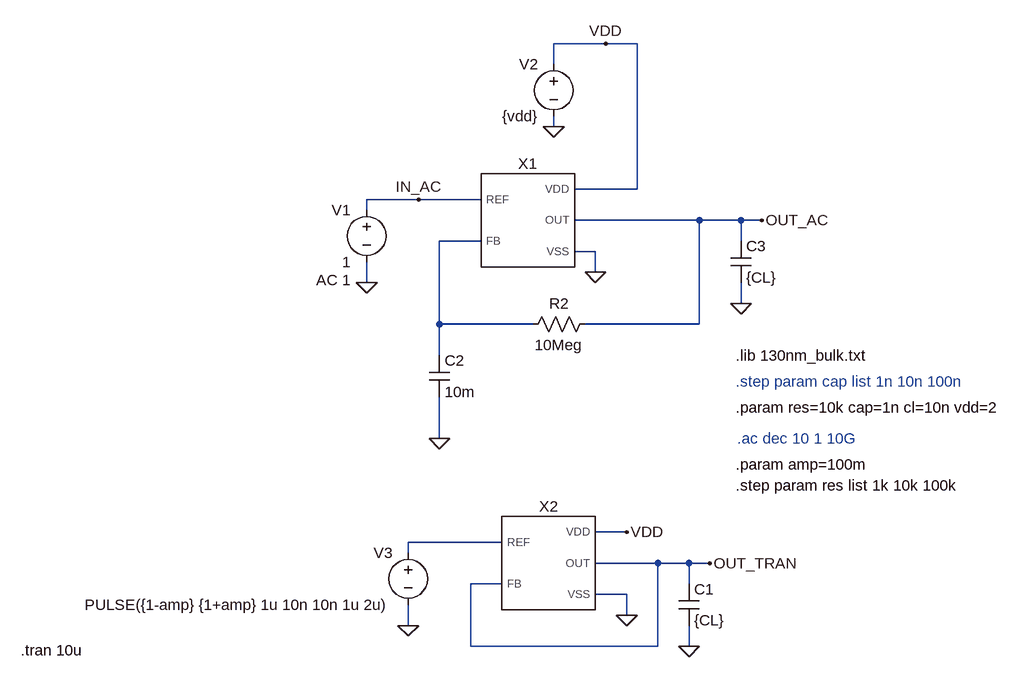
[diagram p0: schematic almost_ideal_curr_src.asc]
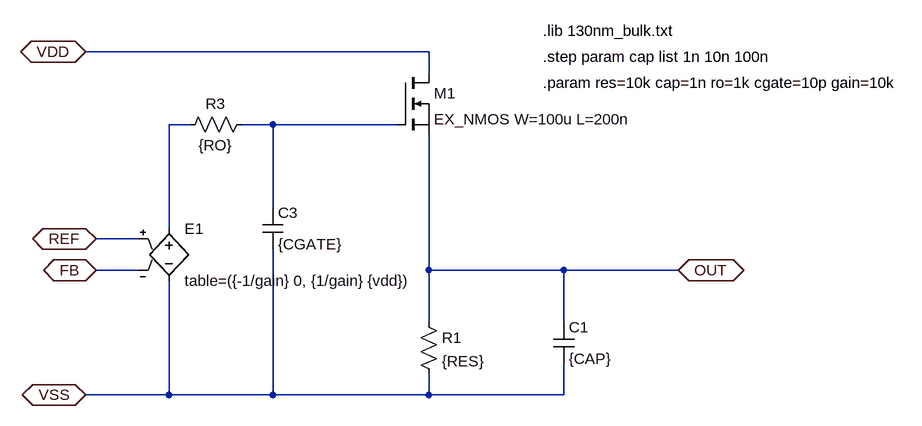
[diagram p1: sub-circuit fake_reference.asc]
almost_ideal_curr_src.asc, the LTspice schematic file:
Version 4
SHEET 1 1424 680
WIRE 96 -560 16 -560
WIRE 144 -560 96 -560
WIRE 16 -528 16 -560
WIRE 16 -432 16 -448
WIRE 144 -336 144 -560
WIRE 144 -336 48 -336
WIRE -192 -320 -272 -320
WIRE -96 -320 -192 -320
WIRE -272 -304 -272 -320
WIRE 240 -288 48 -288
WIRE 304 -288 240 -288
WIRE 336 -288 304 -288
WIRE -96 -256 -160 -256
WIRE 304 -256 304 -288
WIRE 80 -240 48 -240
WIRE 80 -208 80 -240
WIRE -272 -192 -272 -224
WIRE 304 -160 304 -192
WIRE -160 -128 -160 -256
WIRE -16 -128 -160 -128
WIRE 240 -128 240 -288
WIRE 240 -128 64 -128
WIRE -160 -80 -160 -128
WIRE -160 48 -160 -16
WIRE 128 192 80 192
WIRE -64 208 -208 208
WIRE -208 224 -208 208
WIRE 176 240 80 240
WIRE 224 240 176 240
WIRE 256 240 224 240
WIRE -64 272 -112 272
WIRE 224 272 224 240
WIRE 128 288 80 288
WIRE 128 320 128 288
WIRE -208 336 -208 304
WIRE -112 368 -112 272
WIRE 176 368 176 240
WIRE 176 368 -112 368
WIRE 224 368 224 336
FLAG -272 -192 0
FLAG 16 -432 0
FLAG 256 240 OUT_TRAN
FLAG -192 -320 IN_AC
FLAG -160 48 0
FLAG 80 -208 0
FLAG 336 -288 OUT_AC
FLAG 96 -560 VDD
FLAG 128 320 0
FLAG 128 192 VDD
FLAG -208 336 0
FLAG 224 368 0
FLAG 304 -160 0
SYMBOL voltage -272 -320 M0
WINDOW 123 24 124 Left 2
WINDOW 39 0 0 Left 0
SYMATTR InstName V1
SYMATTR Value 1
SYMATTR Value2 AC 1
SYMBOL voltage 16 -544 M0
WINDOW 123 0 0 Left 0
WINDOW 39 0 0 Left 0
SYMATTR InstName V2
SYMATTR Value {vdd}
SYMBOL res 80 -144 R90
WINDOW 0 0 56 VBottom 2
WINDOW 3 32 56 VTop 2
SYMATTR InstName R2
SYMATTR Value 10Meg
SYMBOL cap -176 -80 R0
SYMATTR InstName C2
SYMATTR Value 10m
SYMBOL fake_reference -32 -288 R0
SYMATTR InstName X1
SYMATTR SpiceLine res={res} cap={cap} vdd={vdd}
SYMBOL fake_reference 0 240 R0
SYMATTR InstName X2
SYMATTR SpiceLine res={res} cap={cap} vdd={vdd}
SYMBOL voltage -208 208 M0
WINDOW 123 24 124 Left 2
WINDOW 39 0 0 Left 0
SYMATTR InstName V3
SYMATTR Value PULSE({1-amp} {1+amp} 1u 10n 10n 1u 2u)
SYMBOL cap 208 272 R0
SYMATTR InstName C1
SYMATTR Value {CL}
SYMBOL cap 288 -256 R0
SYMATTR InstName C3
SYMATTR Value {CL}
TEXT 296 -80 Left 2 !.lib 130nm_bulk.txt
TEXT 296 0 Left 2 !.param res=10k cap=1n cl=10n vdd=2
TEXT 298 48 Left 2 ;.ac dec 10 1 10G
TEXT 296 -40 Left 2 ;.step param cap list 1n 10n 100n
TEXT 296 88 Left 2 !.param amp=100m
TEXT -804 374 Left 2 !.tran 10u
TEXT 296 120 Left 2 !.step param res list 1k 10k 100k

fake_reference.asc, the sub-circuit schematic file:
Version 4
SHEET 1 880 680
WIRE 0 -176 -528 -176
WIRE 0 -144 0 -176
WIRE -368 -64 -400 -64
WIRE -240 -64 -288 -64
WIRE -48 -64 -240 -64
WIRE -240 64 -240 -64
WIRE -400 96 -400 -64
WIRE -448 112 -512 112
WIRE -448 160 -512 160
WIRE 0 160 0 -48
WIRE 208 160 0 160
WIRE 384 160 208 160
WIRE 0 240 0 160
WIRE 208 240 208 160
WIRE -400 352 -400 176
WIRE -400 352 -528 352
WIRE -240 352 -240 128
WIRE -240 352 -400 352
WIRE 0 352 0 320
WIRE 0 352 -240 352
WIRE 208 352 208 304
WIRE 208 352 0 352
FLAG 384 160 OUT
IOPIN 384 160 BiDir
FLAG -528 -176 VDD
IOPIN -528 -176 BiDir
FLAG -512 112 REF
IOPIN -512 112 BiDir
FLAG -512 160 FB
IOPIN -512 160 BiDir
FLAG -528 352 VSS
IOPIN -528 352 BiDir
SYMBOL e -400 80 R0
SYMATTR InstName E1
SYMATTR Value table=({-1/gain} 0, {1/gain} {vdd})
SYMBOL res -16 224 R0
SYMATTR InstName R1
SYMATTR Value {RES}
SYMBOL cap 192 240 R0
SYMATTR InstName C1
SYMATTR Value {CAP}
SYMBOL nmos -48 -144 R0
SYMATTR InstName M1
SYMATTR Value EX_NMOS W=100u L=200n
SYMBOL res -272 -80 R90
WINDOW 0 0 56 VBottom 2
WINDOW 3 32 56 VTop 2
SYMATTR InstName R3
SYMATTR Value {RO}
SYMBOL cap -256 64 R0
SYMATTR InstName C3
SYMATTR Value {CGATE}
TEXT 176 -208 Left 2 !.lib 130nm_bulk.txt
TEXT 176 -128 Left 2 !.param res=10k cap=1n ro=1k cgate=10p gain=10k
TEXT 176 -168 Left 2 !.step param cap list 1n 10n 100n

The netlist it stands for:
* almost_ideal_curr_src.asc
V1 IN_AC 0 1 AC 1
V2 VDD 0 {vdd}
R2 OUT_AC N001 10Meg
C2 N001 0 10m
XX1 N001 OUT_AC IN_AC VDD 0 fake_reference params: res={res} cap={cap} vdd={vdd}
XX2 OUT_TRAN OUT_TRAN N002 VDD 0 fake_reference params: res={res} cap={cap} vdd={vdd}
V3 N002 0 PULSE({1-amp} {1+amp} 1u 10n 10n 1u 2u)
C1 OUT_TRAN 0 {CL}
C3 OUT_AC 0 {CL}

* block symbol definitions
.subckt fake_reference FB OUT REF VDD VSS
E1 N001 VSS REF FB table=({-1/gain} 0, {1/gain} {vdd})
R1 OUT VSS {RES}
C1 OUT VSS {CAP}
M1 VDD N002 OUT OUT EX_NMOS W=100u L=200n
R3 N002 N001 {RO}
C3 N002 VSS {CGATE}
.lib 130nm_bulk.txt
.param res=10k cap=1n ro=1k cgate=10p gain=10k
.step param cap list 1n 10n 100n
.ends fake_reference

.model NMOS NMOS
.model PMOS PMOS
.lib standard.mos
.lib 130nm_bulk.txt
.param res=10k cap=1n cl=10n vdd=2
* .ac dec 10 1 10G
* .step param cap list 1n 10n 100n
.param amp=100m
.tran 10u
.step param res list 1k 10k 100k
.backanno
.end